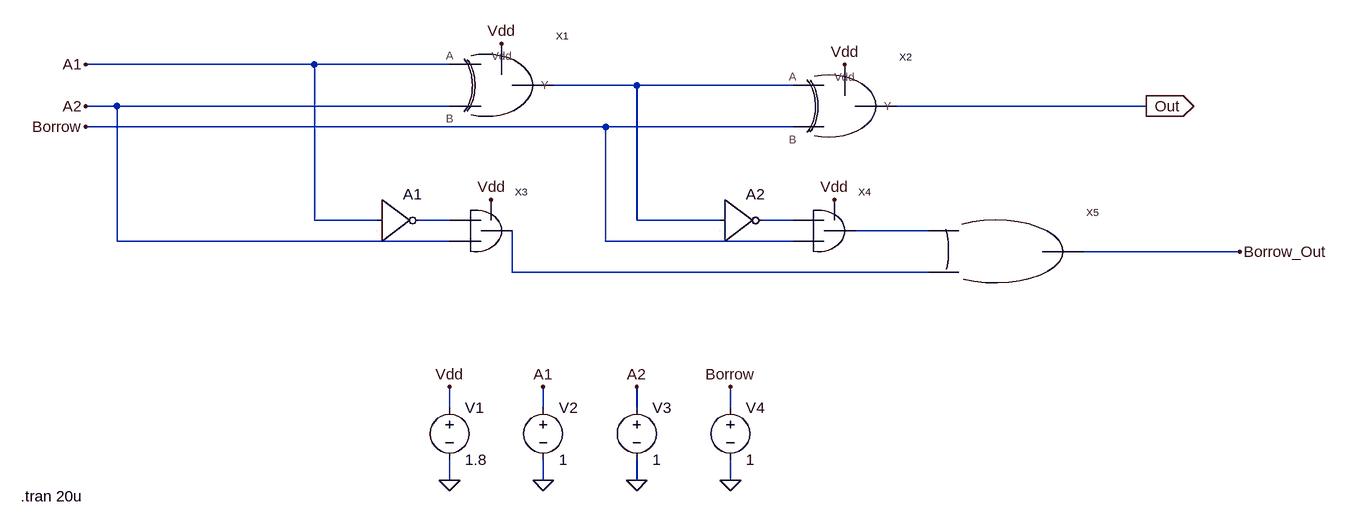
[diagram p0: schematic Full subtractor.asc]
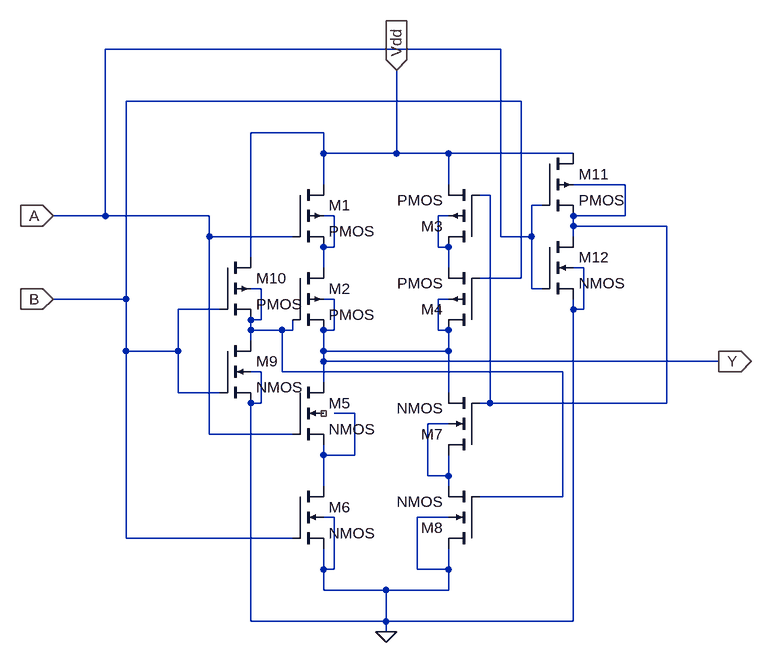
[diagram p1: sub-circuit xor.asc]
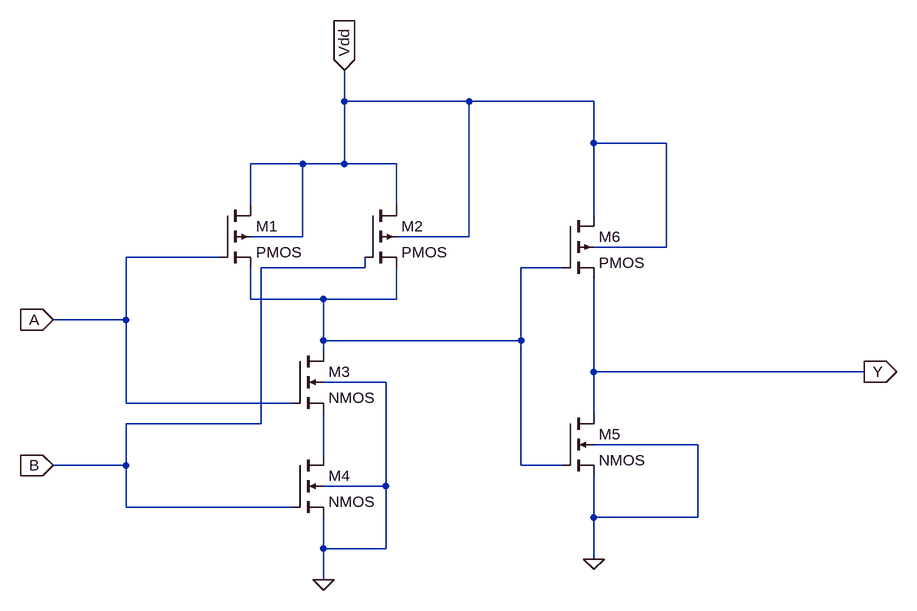
[diagram p2: sub-circuit and.asc]
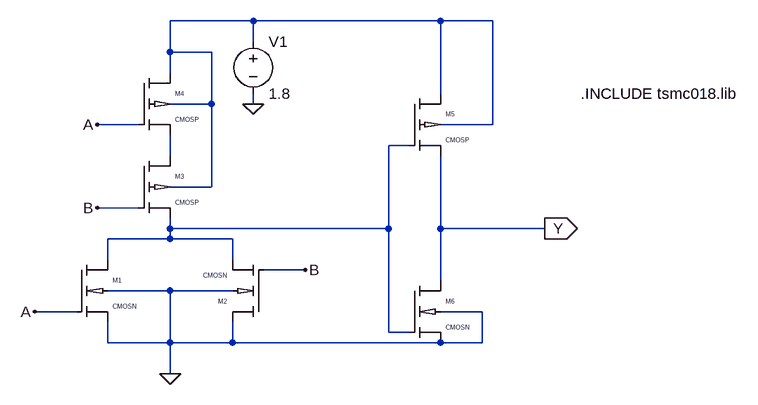
[diagram p3: sub-circuit or.asc]
Full subtractor.asc, the LTspice schematic file:
Version 4
SHEET 1 1520 808
WIRE -64 128 -416 128
WIRE 144 128 -64 128
WIRE 432 160 304 160
WIRE 672 160 432 160
WIRE -368 192 -416 192
WIRE 144 192 -368 192
WIRE 1216 192 832 192
WIRE 384 224 -416 224
WIRE 672 224 384 224
WIRE -64 368 -64 128
WIRE 32 368 -64 368
WIRE 144 368 96 368
WIRE 432 368 432 160
WIRE 560 368 432 368
WIRE 672 368 624 368
WIRE 880 384 768 384
WIRE -368 400 -368 192
WIRE 144 400 -368 400
WIRE 384 400 384 224
WIRE 672 400 384 400
WIRE 1360 416 1120 416
WIRE 240 448 240 384
WIRE 880 448 240 448
WIRE 144 656 144 624
WIRE 288 656 288 624
WIRE 432 656 432 624
WIRE 576 656 576 624
WIRE 144 768 144 736
WIRE 288 768 288 736
WIRE 432 768 432 736
WIRE 576 768 576 736
FLAG -416 128 A1
FLAG -416 192 A2
FLAG -416 224 Borrow
FLAG 224 96 Vdd
FLAG 752 128 Vdd
FLAG 208 336 Vdd
FLAG 736 336 Vdd
FLAG 144 624 Vdd
FLAG 144 768 0
FLAG 288 768 0
FLAG 432 768 0
FLAG 576 768 0
FLAG 288 624 A1
FLAG 432 624 A2
FLAG 576 624 Borrow
FLAG 1216 192 Out
IOPIN 1216 192 Out
FLAG 1360 416 Borrow_Out
SYMBOL XOR 176 176 R0
SYMATTR InstName X1
SYMBOL XOR 704 208 R0
SYMATTR InstName X2
SYMBOL Digital\\inv 32 304 R0
SYMATTR InstName A1
SYMBOL Digital\\inv 560 304 R0
SYMATTR InstName A2
SYMBOL AND 176 400 R0
SYMATTR InstName X3
SYMBOL AND 704 400 R0
SYMATTR InstName X4
SYMBOL OR 992 416 R0
SYMATTR InstName X5
SYMBOL voltage 144 640 R0
WINDOW 123 0 0 Left 0
WINDOW 39 0 0 Left 0
SYMATTR InstName V1
SYMATTR Value 1.8
SYMBOL voltage 288 640 R0
WINDOW 123 0 0 Left 0
WINDOW 39 0 0 Left 0
SYMATTR InstName V2
SYMATTR Value 1
SYMBOL voltage 432 640 R0
WINDOW 123 0 0 Left 0
WINDOW 39 0 0 Left 0
SYMATTR InstName V3
SYMATTR Value 1
SYMBOL voltage 576 640 R0
WINDOW 123 0 0 Left 0
WINDOW 39 0 0 Left 0
SYMATTR InstName V4
SYMATTR Value 1
TEXT -516 792 Left 2 !.tran 20u

xor.asc, the sub-circuit schematic file:
Version 4
SHEET 1 880 740
WIRE 368 -176 -240 -176
WIRE 400 -96 -208 -96
WIRE 96 -48 -16 -48
WIRE 96 -16 96 -48
WIRE 208 -16 208 -144
WIRE 208 -16 96 -16
WIRE 288 -16 208 -16
WIRE 480 -16 288 -16
WIRE 96 32 96 -16
WIRE 288 32 288 -16
WIRE 560 32 480 32
WIRE 352 48 336 48
WIRE 432 64 416 64
WIRE -240 80 -240 -176
WIRE -240 80 -320 80
WIRE -80 80 -240 80
WIRE 112 80 96 80
WIRE 288 80 272 80
WIRE 560 80 560 32
WIRE 560 80 480 80
WIRE 480 96 480 80
WIRE 624 96 480 96
WIRE -80 112 -80 80
WIRE 48 112 -80 112
WIRE 368 112 368 -176
WIRE 416 112 416 64
WIRE 416 112 368 112
WIRE 480 112 480 96
WIRE 112 128 112 80
WIRE 112 128 96 128
WIRE 272 128 272 80
WIRE 288 128 272 128
WIRE -16 144 -16 -48
WIRE 96 160 96 128
WIRE 288 160 288 128
WIRE 496 160 480 160
WIRE 400 176 400 -96
WIRE 400 176 336 176
WIRE 0 192 -16 192
WIRE 416 192 416 112
WIRE 432 192 416 192
WIRE -208 208 -208 -96
WIRE -208 208 -320 208
WIRE 112 208 96 208
WIRE 288 208 272 208
WIRE -64 224 -128 224
WIRE 480 224 480 208
WIRE 496 224 496 160
WIRE 496 224 480 224
WIRE 0 240 0 192
WIRE 0 240 -16 240
WIRE -16 256 -16 240
WIRE 32 256 -16 256
WIRE 48 256 48 240
WIRE 48 256 32 256
WIRE 112 256 112 208
WIRE 112 256 96 256
WIRE 272 256 272 208
WIRE 288 256 272 256
WIRE -16 272 -16 256
WIRE -208 288 -208 208
WIRE -128 288 -128 224
WIRE -128 288 -208 288
WIRE 96 288 96 256
WIRE 288 288 288 256
WIRE 288 288 96 288
WIRE 96 304 96 288
WIRE 704 304 96 304
WIRE 0 320 -16 320
WIRE 32 320 32 256
WIRE 464 320 32 320
WIRE 96 336 96 304
WIRE -128 352 -128 288
WIRE -64 352 -128 352
WIRE 288 352 288 288
WIRE 0 368 0 320
WIRE 0 368 -16 368
WIRE 352 368 352 48
WIRE 352 368 336 368
WIRE 624 368 624 96
WIRE 624 368 352 368
WIRE 144 384 112 384
WIRE 288 400 256 400
WIRE -80 416 -80 112
WIRE 48 416 -80 416
WIRE 96 448 96 432
WIRE 144 448 144 384
WIRE 144 448 96 448
WIRE 256 480 256 400
WIRE 288 480 288 448
WIRE 288 480 256 480
WIRE 96 496 96 448
WIRE 288 496 288 480
WIRE 464 512 464 320
WIRE 464 512 336 512
WIRE 112 544 96 544
WIRE 288 544 240 544
WIRE -208 576 -208 288
WIRE 48 576 -208 576
WIRE 96 624 96 592
WIRE 112 624 112 544
WIRE 112 624 96 624
WIRE 240 624 240 544
WIRE 288 624 288 592
WIRE 288 624 240 624
WIRE 96 656 96 624
WIRE 192 656 96 656
WIRE 288 656 288 624
WIRE 288 656 192 656
WIRE -16 704 -16 368
WIRE 192 704 192 656
WIRE 192 704 -16 704
WIRE 480 704 480 224
WIRE 480 704 192 704
WIRE 192 720 192 704
FLAG 192 720 0
FLAG -320 80 A
IOPIN -320 80 In
FLAG -320 208 B
IOPIN -320 208 In
FLAG 208 -144 Vdd
IOPIN 208 -144 In
FLAG 704 304 Y
IOPIN 704 304 Out
SYMBOL pmos4 48 32 R0
SYMATTR InstName M1
SYMBOL pmos4 48 160 R0
SYMATTR InstName M2
SYMBOL pmos4 336 128 R180
SYMATTR InstName M3
SYMBOL pmos4 336 256 R180
SYMATTR InstName M4
SYMBOL nmos4 48 336 R0
SYMATTR InstName M5
SYMBOL nmos4 48 496 R0
SYMATTR InstName M6
SYMBOL nmos4 336 448 R180
SYMATTR InstName M7
SYMBOL nmos4 336 592 R180
SYMATTR InstName M8
SYMBOL nmos4 -64 272 R0
SYMATTR InstName M9
SYMBOL pmos4 -64 144 R0
SYMATTR InstName M10
SYMBOL pmos4 432 -16 R0
SYMATTR InstName M11
SYMBOL nmos4 432 112 R0
SYMATTR InstName M12

and.asc, the sub-circuit schematic file:
Version 4
SHEET 1 1100 680
WIRE 224 -112 224 -160
WIRE 416 -112 224 -112
WIRE 608 -112 416 -112
WIRE 608 -48 608 -112
WIRE 720 -48 608 -48
WIRE 160 -16 80 -16
WIRE 224 -16 224 -112
WIRE 224 -16 160 -16
WIRE 304 -16 224 -16
WIRE 80 48 80 -16
WIRE 304 48 304 -16
WIRE 608 64 608 -48
WIRE 160 96 160 -16
WIRE 160 96 80 96
WIRE 416 96 416 -112
WIRE 416 96 304 96
WIRE 720 112 720 -48
WIRE 720 112 608 112
WIRE 32 128 -112 128
WIRE 256 144 256 128
WIRE 256 144 96 144
WIRE 560 144 496 144
WIRE 80 192 80 144
WIRE 192 192 80 192
WIRE 304 192 304 144
WIRE 304 192 192 192
WIRE -112 224 -112 128
WIRE -112 224 -224 224
WIRE 192 256 192 192
WIRE 496 256 496 144
WIRE 496 256 192 256
WIRE 192 272 192 256
WIRE 608 304 608 160
WIRE 1024 304 608 304
WIRE 288 320 192 320
WIRE -112 352 -112 224
WIRE 144 352 -112 352
WIRE 608 368 608 304
WIRE 96 384 96 144
WIRE 96 384 -112 384
WIRE 768 416 608 416
WIRE 192 432 192 368
WIRE -112 448 -112 384
WIRE -112 448 -224 448
WIRE 496 448 496 256
WIRE 560 448 496 448
WIRE 288 480 288 320
WIRE 288 480 192 480
WIRE -112 512 -112 448
WIRE 144 512 -112 512
WIRE 608 528 608 464
WIRE 768 528 768 416
WIRE 768 528 608 528
WIRE 192 576 192 528
WIRE 288 576 288 480
WIRE 288 576 192 576
WIRE 608 592 608 528
WIRE 192 624 192 576
FLAG 192 624 0
FLAG -224 224 A
IOPIN -224 224 In
FLAG -224 448 B
IOPIN -224 448 In
FLAG 224 -160 Vdd
IOPIN 224 -160 In
FLAG 608 592 0
FLAG 1024 304 Y
IOPIN 1024 304 Out
SYMBOL pmos4 32 48 R0
SYMATTR InstName M1
SYMBOL nmos4 144 272 R0
SYMATTR InstName M3
SYMBOL nmos4 144 432 R0
SYMATTR InstName M4
SYMBOL nmos4 560 368 R0
SYMATTR InstName M5
SYMBOL pmos4 560 64 R0
SYMATTR InstName M6
SYMBOL pmos4 256 48 R0
SYMATTR InstName M2

or.asc, the sub-circuit schematic file:
Version 4
SHEET 1 1052 680
WIRE 288 -208 160 -208
WIRE 576 -208 288 -208
WIRE 656 -208 576 -208
WIRE 288 -176 288 -208
WIRE 160 -160 160 -208
WIRE 224 -160 160 -160
WIRE 160 -128 160 -160
WIRE 576 -96 576 -208
WIRE 224 -80 224 -160
WIRE 224 -80 160 -80
WIRE 288 -80 288 -96
WIRE 112 -48 48 -48
WIRE 656 -48 656 -208
WIRE 656 -48 576 -48
WIRE 528 -16 496 -16
WIRE 160 0 160 -32
WIRE 224 48 224 -80
WIRE 224 48 160 48
WIRE 112 80 48 80
WIRE 160 112 160 96
WIRE 496 112 496 -16
WIRE 496 112 160 112
WIRE 576 112 576 0
WIRE 736 112 576 112
WIRE 160 128 160 112
WIRE 160 128 64 128
WIRE 256 128 160 128
WIRE 64 160 64 128
WIRE 256 160 256 128
WIRE 368 176 304 176
WIRE 576 192 576 112
WIRE 160 208 64 208
WIRE 256 208 160 208
WIRE 16 240 -48 240
WIRE 640 240 576 240
WIRE 496 272 496 112
WIRE 528 272 496 272
WIRE 64 288 64 256
WIRE 160 288 160 208
WIRE 160 288 64 288
WIRE 256 288 256 256
WIRE 256 288 160 288
WIRE 576 288 256 288
WIRE 640 288 640 240
WIRE 640 288 576 288
WIRE 160 336 160 288
FLAG 160 336 0
FLAG 288 -80 0
FLAG 48 -48 A
FLAG -48 240 A
FLAG 48 80 B
FLAG 368 176 B
FLAG 736 112 Y
IOPIN 736 112 Out
SYMBOL Ncmos 16 160 R0
SYMATTR InstName M1
SYMATTR Value2 l=180n w=360n
SYMBOL Ncmos 304 256 R180
SYMATTR InstName M2
SYMATTR Value2 l=180n w=360n
SYMBOL Pcmos 112 0 R0
SYMATTR InstName M3
SYMATTR Value2 l=180n w=360n
SYMBOL Pcmos 112 -128 R0
SYMATTR InstName M4
SYMATTR Value2 l=180n w=360n
SYMBOL voltage 288 -192 R0
WINDOW 123 0 0 Left 0
WINDOW 39 0 0 Left 0
SYMATTR InstName V1
SYMATTR Value 1.8
SYMBOL Pcmos 528 -96 R0
SYMATTR InstName M5
SYMATTR Value2 l=180n w=360n
SYMBOL Ncmos 528 192 R0
SYMATTR InstName M6
SYMATTR Value2 l=180n w=360n
TEXT 792 -96 Left 2 !.INCLUDE tsmc018.lib

The netlist it stands for:
* Full subtractor.asc
XX1 A1 A2 Vdd N001 xor
XX2 N001 Borrow Vdd Out xor
A1 A1 0 0 0 0 N002 0 0 BUF
A2 N001 0 0 0 0 N003 0 0 BUF
XX3 N002 A2 Vdd N005 and
XX4 N003 Borrow Vdd N004 and
XX5 N004 N005 Borrow_Out or
V1 Vdd 0 1.8
V2 A1 0 1
V3 A2 0 1
V4 Borrow 0 1

* block symbol definitions
.subckt xor A B Vdd Y
M1 Vdd A N002 N002 PMOS
M2 N002 N004 Y Y PMOS
M3 N003 N001 Vdd N003 PMOS
M4 Y B N003 Y PMOS
M5 Y A N005 NC_01 NMOS
M6 N005 B 0 0 NMOS
M7 N006 N001 Y N006 NMOS
M8 0 N004 N006 0 NMOS
M9 N004 B 0 0 NMOS
M10 Vdd B N004 N004 PMOS
M11 Vdd A N001 N001 PMOS
M12 N001 A 0 0 NMOS
.ends xor

.subckt and A B Vdd Y
M1 Vdd A N001 Vdd PMOS
M3 N001 A N002 0 NMOS
M4 N002 B 0 0 NMOS
M5 Y N001 0 0 NMOS
M6 Vdd N001 Y Vdd PMOS
M2 Vdd B N001 Vdd PMOS
.ends and

.subckt or A B Y
M1 N002 A 0 0 CMOSN l=180n w=360n
M2 0 B N002 0 CMOSN l=180n w=360n
M3 N003 B N002 N001 CMOSP l=180n w=360n
M4 N001 A N003 N001 CMOSP l=180n w=360n
V1 N001 0 1.8
M5 N001 N002 Y N001 CMOSP l=180n w=360n
M6 Y N002 0 0 CMOSN l=180n w=360n
.INCLUDE tsmc018.lib
.ends or

.model NMOS NMOS
.model PMOS PMOS
.lib standard.mos
.tran 20u
.lib tsmc018.lib
.backanno
.end